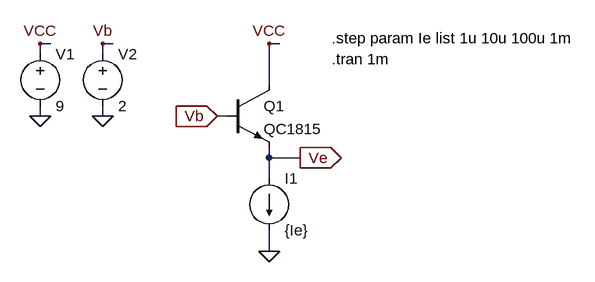
[diagram p0: schematic Vbe_Check_CurrentSource.asc]
Vbe_Check_CurrentSource.asc, the LTspice schematic file:
Version 4
SHEET 1 880 680
WIRE -80 -32 -96 -32
WIRE 16 -32 0 -32
WIRE 272 -32 256 -32
WIRE -96 -16 -96 -32
WIRE 0 -16 0 -32
WIRE 256 32 256 -32
WIRE -96 80 -96 64
WIRE 0 80 0 64
WIRE 192 80 176 80
WIRE 256 144 256 128
WIRE 304 144 256 144
WIRE 256 176 256 144
WIRE 256 288 256 256
FLAG 256 288 0
FLAG 256 -32 VCC
FLAG -96 80 0
FLAG -96 -32 VCC
FLAG 304 144 Ve
IOPIN 304 144 Out
FLAG 0 80 0
FLAG 0 -32 Vb
FLAG 176 80 Vb
IOPIN 176 80 In
SYMBOL current 256 176 R0
WINDOW 123 0 0 Left 2
WINDOW 39 0 0 Left 2
SYMATTR InstName I1
SYMATTR Value {Ie}
SYMBOL npn 192 32 R0
SYMATTR InstName Q1
SYMATTR Value QC1815
SYMBOL voltage -96 -32 R0
WINDOW 123 0 0 Left 2
WINDOW 39 0 0 Left 2
SYMATTR InstName V1
SYMATTR Value 9
SYMBOL voltage 0 -32 R0
WINDOW 123 0 0 Left 2
WINDOW 39 0 0 Left 2
SYMATTR InstName V2
SYMATTR Value 2
TEXT 352 -8 Left 2 !.tran 1m
TEXT 352 -40 Left 2 !.step param Ie list 1u 10u 100u 1m

The netlist it stands for:
* Vbe_Check_CurrentSource.asc
I1 Ve 0 {Ie}
Q1 VCC Vb Ve 0 QC1815
V1 VCC 0 9
V2 Vb 0 2
.model NPN NPN
.model PNP PNP
.lib standard.bjt
.tran 1m
.step param Ie list 1u 10u 100u 1m
.backanno
.end